# Altium project FMC_130MSPS.PrjPCB (part 1 of 2)
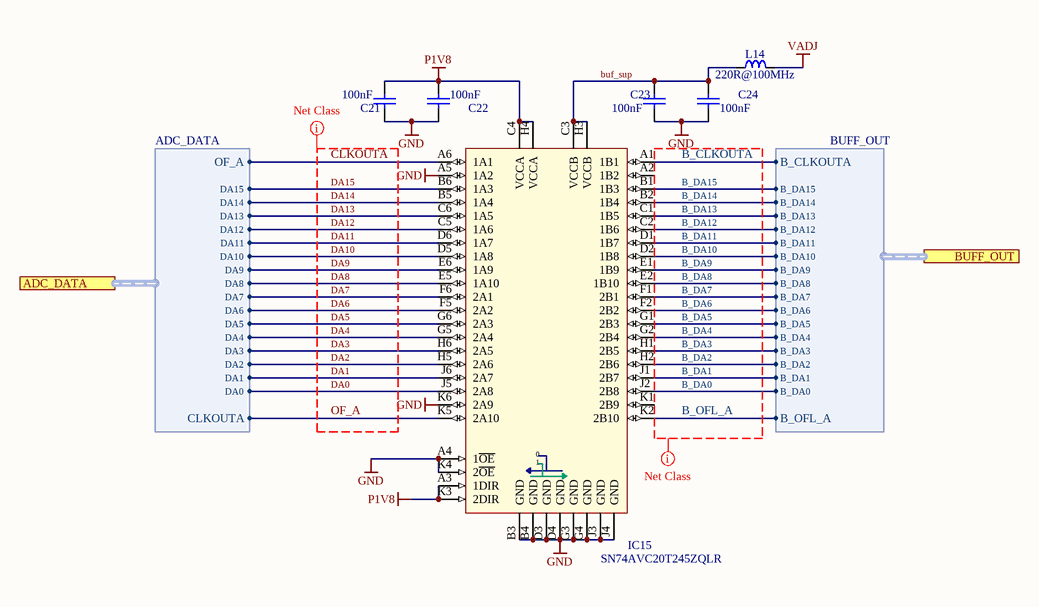
[diagram p0: BUFFER.SchDoc]
5 sheets, 124 parts. Net scope: hierarchical (ports join the sheet entries above them; power ports are global).
Board file: FMC_ADC_130M_16B_4CH.PcbDoc
Sheets:
  BUFFER.SchDoc
  FMC connector.SchDoc
  ADC.SchDoc
  power_supply.SchDoc
  Triggers.SchDoc

## Sheet BUFFER.SchDoc
size A4

### Parts
C21  100nF  [CAPC0603X33N]
C22  100nF  [CAPC0603X33N]
C23  100nF  [CAPC0603X33N]
C24  100nF  [CAPC0603X33N]
IC15  SN74AVC20T245ZQLR  [ZQL56(R-PBGA-N56)]
L14  220R@100MHz  [INDC2012X105N]

### Ports
ADC_DATA (harness ADC_DATA), BUFF_OUT (harness BUFF_OUT)

### Harnesses
BUFF_OUT: B_CLKOUTA, B_OFL_A, B_DA15, B_DA14, B_DA13, B_DA12, B_DA11, B_DA10, B_DA9, B_DA8, B_DA7, B_DA6, B_DA5, B_DA4, B_DA3, B_DA2, B_DA1, B_DA0
ADC_DATA: CLKOUTA, OF_A, DA15, DA14, DA13, DA12, DA11, DA10, DA9, DA8, DA7, DA6, DA5, DA4, DA3, DA2, DA1, DA0

### Nets
GND: C21.1 C22.1 C23.1 C24.1 IC15.A4(1~{OE}) IC15.A5(1A2) IC15.B3(GND) IC15.B4(GND) IC15.D3(GND) IC15.D4(GND) IC15.G3(GND) IC15.G4(GND) IC15.J3(GND) IC15.J4(GND) IC15.K4(2~{OE}) IC15.K6(2A9)
P1V8: C21.2 C22.2 IC15.A3(1DIR) IC15.C4(VCCA) IC15.H4(VCCA) IC15.K3(2DIR)
VADJ: L14.2
B_CLKOUTA: IC15.A1(1B1) ; port BUFF_OUT.B_CLKOUTA
B_DA0: IC15.J2(2B8) ; port BUFF_OUT.B_DA0
B_DA1: IC15.J1(2B7) ; port BUFF_OUT.B_DA1
B_DA2: IC15.H2(2B6) ; port BUFF_OUT.B_DA2
B_DA3: IC15.H1(2B5) ; port BUFF_OUT.B_DA3
B_DA4: IC15.G2(2B4) ; port BUFF_OUT.B_DA4
B_DA5: IC15.G1(2B3) ; port BUFF_OUT.B_DA5
B_DA6: IC15.F2(2B2) ; port BUFF_OUT.B_DA6
B_DA7: IC15.F1(2B1) ; port BUFF_OUT.B_DA7
B_DA8: IC15.E2(1B10) ; port BUFF_OUT.B_DA8
B_DA9: IC15.E1(1B9) ; port BUFF_OUT.B_DA9
B_DA10: IC15.D2(1B8) ; port BUFF_OUT.B_DA10
B_DA11: IC15.D1(1B7) ; port BUFF_OUT.B_DA11
B_DA12: IC15.C2(1B6) ; port BUFF_OUT.B_DA12
B_DA13: IC15.C1(1B5) ; port BUFF_OUT.B_DA13
B_DA14: IC15.B2(1B4) ; port BUFF_OUT.B_DA14
B_DA15: IC15.B1(1B3) ; port BUFF_OUT.B_DA15
B_OFL_A: IC15.K2(2B10) ; port BUFF_OUT.B_OFL_A
buf_sup: C23.2 C24.2 IC15.C3(VCCB) IC15.H3(VCCB) L14.1
CLKOUTA: IC15.A6(1A1) ; port ADC_DATA.OF_A
DA0: IC15.J5(2A8) ; port ADC_DATA.DA0
DA1: IC15.J6(2A7) ; port ADC_DATA.DA1
DA2: IC15.H5(2A6) ; port ADC_DATA.DA2
DA3: IC15.H6(2A5) ; port ADC_DATA.DA3
DA4: IC15.G5(2A4) ; port ADC_DATA.DA4
DA5: IC15.G6(2A3) ; port ADC_DATA.DA5
DA6: IC15.F5(2A2) ; port ADC_DATA.DA6
DA7: IC15.F6(2A1) ; port ADC_DATA.DA7
DA8: IC15.E5(1A10) ; port ADC_DATA.DA8
DA9: IC15.E6(1A9) ; port ADC_DATA.DA9
DA10: IC15.D5(1A8) ; port ADC_DATA.DA10
DA11: IC15.D6(1A7) ; port ADC_DATA.DA11
DA12: IC15.C5(1A6) ; port ADC_DATA.DA12
DA13: IC15.C6(1A5) ; port ADC_DATA.DA13
DA14: IC15.B5(1A4) ; port ADC_DATA.DA14
DA15: IC15.B6(1A3) ; port ADC_DATA.DA15
OF_A: IC15.K5(2A10) ; port ADC_DATA.CLKOUTA

Not connected (* = marked no-connect by the designer): IC15 A2(1B2) K1(2B9)

### Layout directives
net class Buff_data: B_CLKOUTA, B_DA0, B_DA1, B_DA2, B_DA3, B_DA4, B_DA5, B_DA6, B_DA7, B_DA8, B_DA9, B_DA10, B_DA11, B_DA12, B_DA13, B_DA14, B_DA15, B_OFL_A
net class ADC_data: CLKOUTA, DA0, DA1, DA2, DA3, DA4, DA5, DA6, DA7, DA8, DA9, DA10, DA11, DA12, DA13, DA14, DA15, OF_A

### Notes on the sheet
- (in symbol 74AVC20T245) 0; 1

### Library data of the parts
C21-C24 = CC0201_100NF_6.3V_10%_X5R: Non-polarised capacitor; Part Description: SMD Multilayer Chip Ceramic Capacitor; Manufacturer: GENERIC; Manufacturer1 Part Number: 02016D104KAT2A; Voltage: 6.3V; TC: X5R; Tolerance: ±10%; Table: Capacitors SMD; Part Number: CC0201_100NF_6.3V_10%_X5R; Component Kind: Standard; Component Type: Standard; Pin Count: 2; Value: 100nF; Status: Not Recommended; Manufacturer Part Number: CC0201_100NF_6.3V_10%_X5R; Case: 0201; Mounted: Yes; Socket: No; SMD: Yes; Manufacturer1 Example: AVX; Manufacturer1 ComponentHeight: 0.33mm; HelpURL: \\cern.ch\dfs\Applications\Altium\Datasheets\CC0201_X5R_AVX.pdf; Author: CERN DEM JLC; CreateDate: 2007-12-03; LatestRevisionDate: 2007-12-03
IC15 = 74AVC20T245: 20-BIT DUAL SUPPLY BUS TRANSCEIVER; Supplier 1: Digi-Key; Supplier Part Number 1: 296-19097-1-ND; partnumber: SN74AVC20T245ZQLR
L14 = IND0805_MURATA_BLM21PG221SN1D: Inductor; Part Description: SMD EMIFIL Suppression Chip Ferrite Bead; Manufacturer: MURATA; Power: 2A; Resistance: 0.05R; Tolerance: ±25%; Table: Inductors SMD; Part Number: IND0805_MURATA_BLM21PG221SN1D; Component Kind: Standard; Component Type: Standard; Pin Count: 2; Value: 220R@100MHz; Status: None; Manufacturer Part Number: BLM21PG221SN1D; Case: 0805; Mounted: Yes; Socket: No; SMD: Yes; ComponentHeight: 1.05mm; HelpURL: \\cern.ch\dfs\Applications\Altium\Datasheets\IND0402_MURATA_BLM21P.pdf; Author: CERN DEM JLC; CreateDate: 25/1/2010; LatestRevisionDate: 25/1/2010

## Sheet FMC connector.SchDoc
size A3
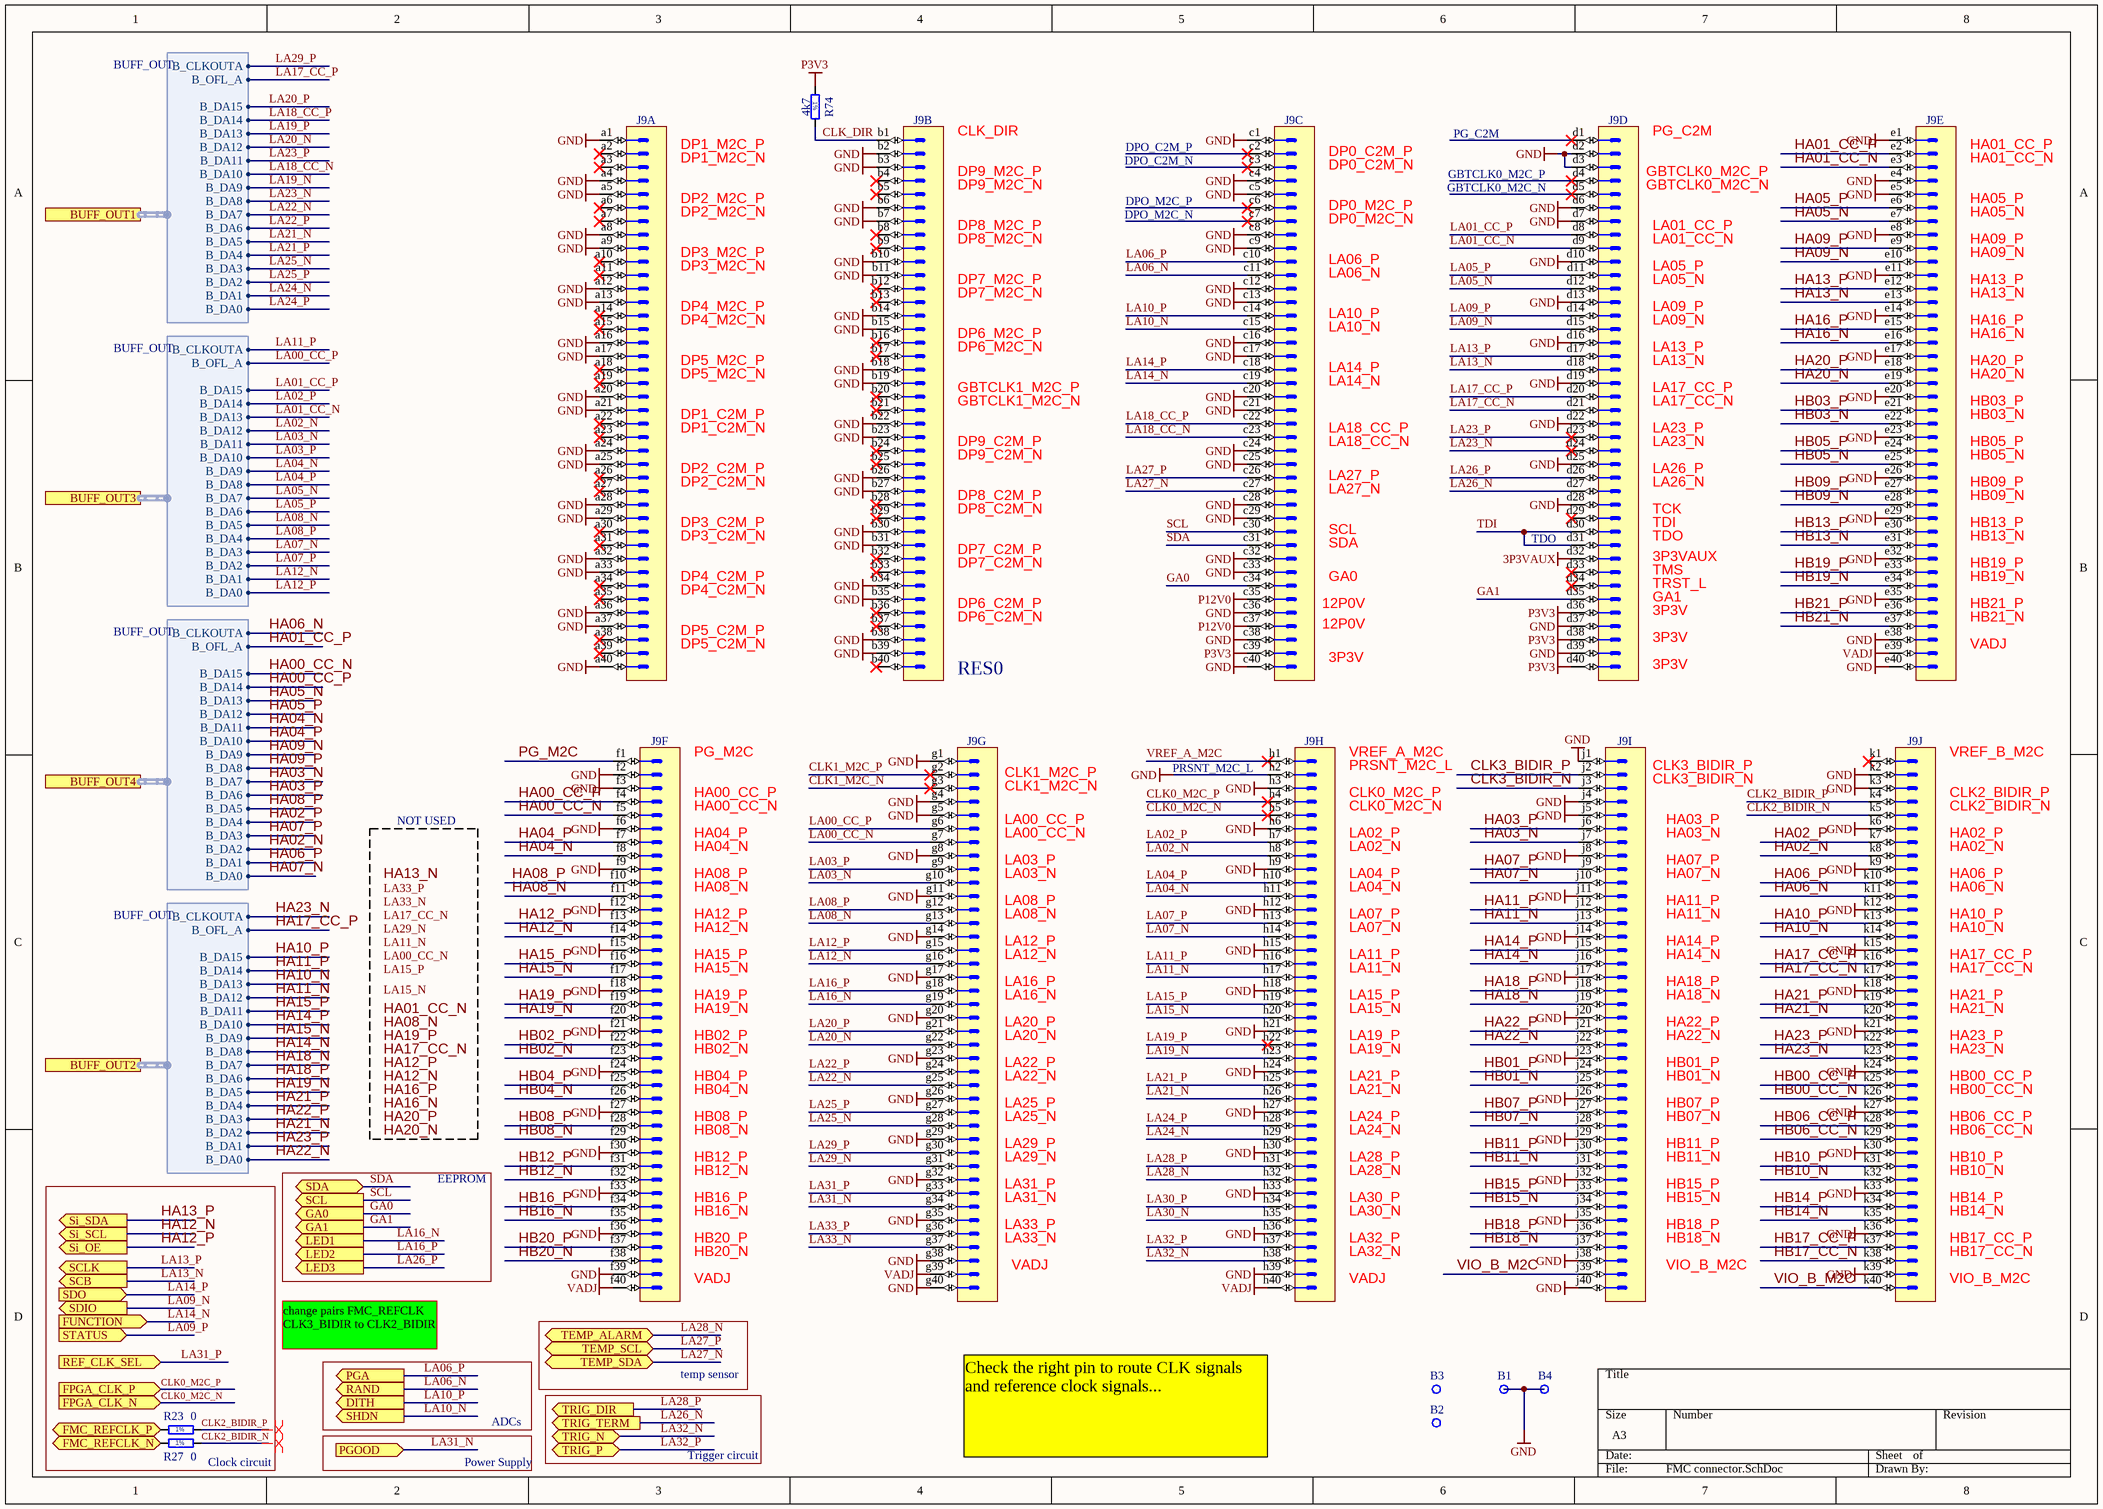
[diagram p1: FMC connector.SchDoc]

### Parts
B1  Plated Hole  [MTG300_600]  (value not drawn)
B2  Plated Hole  [MTG300_600]  (value not drawn)
B3  Plated Hole  [MTG300_600]  (value not drawn)
B4  Plated Hole  [MTG300_600]  (value not drawn)
J9  VITA 57  [SAMTEC_ASP-134488-01]  (value not drawn)  (parts A,B,C,D,E,F,G,H,I,J of 10)
R23  0  [RESC1005X40N]
R27  0  [RESC1005X40N]
R74  4k7  [RESC1608X55N]

### Blocks framed on the sheet
Clock circuit: R23 R27

### Ports
BUFF_OUT1 (harness BUFF_OUT), BUFF_OUT2 (harness BUFF_OUT), BUFF_OUT3 (harness BUFF_OUT), BUFF_OUT4 (harness BUFF_OUT), DITH (out), FMC_REFCLK_N (out), FMC_REFCLK_P (out), FPGA_CLK_N (in), FPGA_CLK_P (in), FUNCTION (in), GA0 (out), GA1 (out), LED1 (out), LED2 (out), LED3 (out), PGA (out), PGOOD (in), RAND (out), REF_CLK_SEL (in), SCB (out), SCL (out), SCLK (out), SDA (bidir), SDIO (out), SDO (in), SHDN (out), Si_OE (out), Si_SCL (out), Si_SDA (out), STATUS (in), TEMP_ALARM (bidir), TEMP_SCL (bidir), TEMP_SDA (bidir), TRIG_DIR (out), TRIG_N (bidir), TRIG_P (bidir), TRIG_TERM (out)

### Harnesses
BUFF_OUT: B_CLKOUTA, B_OFL_A, B_DA0, B_DA1, B_DA2, B_DA3, B_DA4, B_DA5, B_DA6, B_DA7, B_DA8, B_DA9, B_DA10, B_DA11, B_DA12, B_DA13, B_DA14, B_DA15

### Nets
3P3VAUX: J9.d32
GND: B1.1 B4.1 J9.a1 J9.a4 J9.a5 J9.a8 J9.a9 J9.a12 J9.a13 J9.a16 J9.a17 J9.a20 J9.a21 J9.a24 J9.a25 J9.a28 J9.a29 J9.a32 J9.a33 J9.a36 J9.a37 J9.a40 J9.b2 J9.b3 J9.b6 J9.b7 J9.b10 J9.b11 J9.b14 J9.b15 J9.b18 J9.b19 J9.b22 J9.b23 J9.b26 J9.b27 J9.b30 J9.b31 J9.b34 J9.b35 J9.b38 J9.b39 J9.c1 J9.c4 J9.c5 J9.c8 J9.c9 J9.c12 J9.c13 J9.c16 J9.c17 J9.c20 J9.c21 J9.c24 J9.c25 J9.c28 J9.c29 J9.c32 J9.c33 J9.c36 J9.c38 J9.c40 J9.d2 J9.d3 J9.d6 J9.d7 J9.d10 J9.d13 J9.d16 J9.d19 J9.d22 J9.d25 J9.d28 J9.d37 J9.d39 J9.e1 J9.e4 J9.e5 J9.e8 J9.e11 J9.e14 J9.e17 J9.e20 J9.e23 J9.e26 J9.e29 J9.e32 J9.e35 J9.e38 J9.e40 J9.f2 J9.f3 J9.f6 J9.f9 J9.f12 J9.f15 J9.f18 J9.f21 J9.f24 J9.f27 J9.f30 J9.f33 J9.f36 J9.f39 J9.g1 J9.g4 J9.g5 J9.g8 J9.g11 J9.g14 J9.g17 J9.g20 J9.g23 J9.g26 J9.g29 J9.g32 J9.g35 J9.g38 J9.g40 J9.h2 J9.h3 J9.h6 J9.h9 J9.h12 J9.h15 J9.h18 J9.h21 J9.h24 J9.h27 J9.h30 J9.h33 J9.h36 J9.h39 J9.j1 J9.j4 J9.j5 J9.j8 J9.j11 J9.j14 J9.j17 J9.j20 J9.j23 J9.j26 J9.j29 J9.j32 J9.j35 J9.j38 J9.j40 J9.k2 J9.k3 J9.k6 J9.k9 J9.k12 J9.k15 J9.k18 J9.k21 J9.k24 J9.k27 J9.k30 J9.k33 J9.k36 J9.k39
P3V3: J9.c39 J9.d36 J9.d38 J9.d40 R74.1
P12V0: J9.c35 J9.c37
VADJ: J9.e39 J9.f40 J9.g39 J9.h40
CLK0_M2C_N: J9.h5 ; port FPGA_CLK_N
CLK0_M2C_P: J9.h4 ; port FPGA_CLK_P
CLK1_M2C_N: J9.g3
CLK1_M2C_P: J9.g2
CLK2_BIDIR_N: J9.k5 R27.2
CLK2_BIDIR_P: J9.k4 R23.2
CLK3_BIDIR_N: J9.j3
CLK3_BIDIR_P: J9.j2
CLK_DIR: J9.b1 R74.2
GA0: J9.c34 ; port GA0
GA1: J9.d35 ; port GA1
HA00_CC_N: J9.f5 ; port BUFF_OUT4.B_DA15
HA00_CC_P: J9.f4 ; port BUFF_OUT4.B_DA14
HA01_CC_N: J9.e3
HA01_CC_P: J9.e2 ; port BUFF_OUT4.B_OFL_A
HA02_N: J9.k8 ; port BUFF_OUT4.B_DA2
HA02_P: J9.k7 ; port BUFF_OUT4.B_DA4
HA03_N: J9.j7 ; port BUFF_OUT4.B_DA7
HA03_P: J9.j6 ; port BUFF_OUT4.B_DA6
HA04_N: J9.f8 ; port BUFF_OUT4.B_DA11
HA04_P: J9.f7 ; port BUFF_OUT4.B_DA10
HA05_N: J9.e7 ; port BUFF_OUT4.B_DA13
HA05_P: J9.e6 ; port BUFF_OUT4.B_DA12
HA06_N: J9.k11 ; port BUFF_OUT4.B_CLKOUTA
HA06_P: J9.k10 ; port BUFF_OUT4.B_DA1
HA07_N: J9.j10 ; port BUFF_OUT4.B_DA0
HA07_P: J9.j9 ; port BUFF_OUT4.B_DA3
HA08_N: J9.f11
HA08_P: J9.f10 ; port BUFF_OUT4.B_DA5
HA09_N: J9.e10 ; port BUFF_OUT4.B_DA9
HA09_P: J9.e9 ; port BUFF_OUT4.B_DA8
HA10_N: J9.k14 ; port BUFF_OUT2.B_DA13
HA10_P: J9.k13 ; port BUFF_OUT2.B_DA15
HA11_N: J9.j13 ; port BUFF_OUT2.B_DA12
HA11_P: J9.j12 ; port BUFF_OUT2.B_DA14
HA12_N: J9.f14 ; port Si_SCL
HA12_P: J9.f13 ; port Si_OE
HA13_N: J9.e13
HA13_P: J9.e12 ; port Si_SDA
HA14_N: J9.j16 ; port BUFF_OUT2.B_DA8
HA14_P: J9.j15 ; port BUFF_OUT2.B_DA10
HA15_N: J9.f17 ; port BUFF_OUT2.B_DA9
HA15_P: J9.f16 ; port BUFF_OUT2.B_DA11
HA16_N: J9.e16
HA16_P: J9.e15
HA17_CC_N: J9.k17
HA17_CC_P: J9.k16 ; port BUFF_OUT2.B_OFL_A
HA18_N: J9.j19 ; port BUFF_OUT2.B_DA7
HA18_P: J9.j18 ; port BUFF_OUT2.B_DA6
HA19_N: J9.f20 ; port BUFF_OUT2.B_DA5
HA19_P: J9.f19
HA20_N: J9.e19
HA20_P: J9.e18
HA21_N: J9.k20 ; port BUFF_OUT2.B_DA2
HA21_P: J9.k19 ; port BUFF_OUT2.B_DA4
HA22_N: J9.j22 ; port BUFF_OUT2.B_DA0
HA22_P: J9.j21 ; port BUFF_OUT2.B_DA3
HA23_N: J9.k23 ; port BUFF_OUT2.B_CLKOUTA
HA23_P: J9.k22 ; port BUFF_OUT2.B_DA1
HB00_CC_N: J9.k26
HB00_CC_P: J9.k25
HB01_N: J9.j25
HB01_P: J9.j24
HB02_N: J9.f23
HB02_P: J9.f22
HB03_N: J9.e22
HB03_P: J9.e21
HB04_N: J9.f26
HB04_P: J9.f25
HB05_N: J9.e25
HB05_P: J9.e24
HB06_CC_N: J9.k29
HB06_CC_P: J9.k28
HB07_N: J9.j28
HB07_P: J9.j27
HB08_N: J9.f29
HB08_P: J9.f28
HB09_N: J9.e28
HB09_P: J9.e27
HB10_N: J9.k32
HB10_P: J9.k31
HB11_N: J9.j31
HB11_P: J9.j30
HB12_N: J9.f32
HB12_P: J9.f31
HB13_N: J9.e31
HB13_P: J9.e30
HB14_N: J9.k35
HB14_P: J9.k34
HB15_N: J9.j34
HB15_P: J9.j33
HB16_N: J9.f35
HB16_P: J9.f34
HB17_CC_N: J9.k38
HB17_CC_P: J9.k37
HB18_N: J9.j37
HB18_P: J9.j36
HB19_N: J9.e34
HB19_P: J9.e33
HB20_N: J9.f38
HB20_P: J9.f37
HB21_N: J9.e37
HB21_P: J9.e36
LA00_CC_N: J9.g7
LA00_CC_P: J9.g6 ; port BUFF_OUT3.B_OFL_A
LA01_CC_N: J9.d9 ; port BUFF_OUT3.B_DA13
LA01_CC_P: J9.d8 ; port BUFF_OUT3.B_DA15
LA02_N: J9.h8 ; port BUFF_OUT3.B_DA12
LA02_P: J9.h7 ; port BUFF_OUT3.B_DA14
LA03_N: J9.g10 ; port BUFF_OUT3.B_DA11
LA03_P: J9.g9 ; port BUFF_OUT3.B_DA10
LA04_N: J9.h11 ; port BUFF_OUT3.B_DA9
LA04_P: J9.h10 ; port BUFF_OUT3.B_DA8
LA05_N: J9.d12 ; port BUFF_OUT3.B_DA7
LA05_P: J9.d11 ; port BUFF_OUT3.B_DA6
LA06_N: J9.c11 ; port RAND
LA06_P: J9.c10 ; port PGA
LA07_N: J9.h14 ; port BUFF_OUT3.B_DA3
LA07_P: J9.h13 ; port BUFF_OUT3.B_DA2
LA08_N: J9.g13 ; port BUFF_OUT3.B_DA5
LA08_P: J9.g12 ; port BUFF_OUT3.B_DA4
LA09_N: J9.d15 ; port SDIO
LA09_P: J9.d14 ; port STATUS
LA10_N: J9.c15 ; port SHDN
LA10_P: J9.c14 ; port DITH
LA11_N: J9.h17
LA11_P: J9.h16 ; port BUFF_OUT3.B_CLKOUTA
LA12_N: J9.g16 ; port BUFF_OUT3.B_DA1
LA12_P: J9.g15 ; port BUFF_OUT3.B_DA0
LA13_N: J9.d18 ; port SCB
LA13_P: J9.d17 ; port SCLK
LA14_N: J9.c19 ; port FUNCTION
LA14_P: J9.c18 ; port SDO
LA15_N: J9.h20
LA15_P: J9.h19
LA16_N: J9.g19 ; port LED1
LA16_P: J9.g18 ; port LED2
LA17_CC_N: J9.d21
LA17_CC_P: J9.d20 ; port BUFF_OUT1.B_OFL_A
LA18_CC_N: J9.c23 ; port BUFF_OUT1.B_DA10
LA18_CC_P: J9.c22 ; port BUFF_OUT1.B_DA14
LA19_N: J9.h23 ; port BUFF_OUT1.B_DA9
LA19_P: J9.h22 ; port BUFF_OUT1.B_DA13
LA20_N: J9.g22 ; port BUFF_OUT1.B_DA12
LA20_P: J9.g21 ; port BUFF_OUT1.B_DA15
LA21_N: J9.h26 ; port BUFF_OUT1.B_DA5
LA21_P: J9.h25 ; port BUFF_OUT1.B_DA4
LA22_N: J9.g25 ; port BUFF_OUT1.B_DA7
LA22_P: J9.g24 ; port BUFF_OUT1.B_DA6
LA23_N: J9.d24 ; port BUFF_OUT1.B_DA8
LA23_P: J9.d23 ; port BUFF_OUT1.B_DA11
LA24_N: J9.h29 ; port BUFF_OUT1.B_DA1
LA24_P: J9.h28 ; port BUFF_OUT1.B_DA0
LA25_N: J9.g28 ; port BUFF_OUT1.B_DA3
LA25_P: J9.g27 ; port BUFF_OUT1.B_DA2
LA26_N: J9.d27 ; port TRIG_TERM
LA26_P: J9.d26 ; port LED3
LA27_N: J9.c27 ; port TEMP_SDA
LA27_P: J9.c26 ; port TEMP_SCL
LA28_N: J9.h32 ; port TEMP_ALARM
LA28_P: J9.h31 ; port TRIG_DIR
LA29_N: J9.g31
LA29_P: J9.g30 ; port BUFF_OUT1.B_CLKOUTA
LA30_N: J9.h35
LA30_P: J9.h34
LA31_N: J9.g34 ; port PGOOD
LA31_P: J9.g33 ; port REF_CLK_SEL
LA32_N: J9.h38 ; port TRIG_N
LA32_P: J9.h37 ; port TRIG_P
LA33_N: J9.g37
LA33_P: J9.g36
PG_M2C: J9.f1
SCL: J9.c30 ; port SCL
SDA: J9.c31 ; port SDA
TDI: J9.d30 J9.d31
VIO_B_M2C: J9.j39 J9.k40
VREF_A_M2C: J9.h1
NetR23_1: R23.1 ; port FMC_REFCLK_P
NetR27_1: R27.1 ; port FMC_REFCLK_N

Not connected (* = marked no-connect by the designer): B2 1; B3 1; J9 a2* a3* a6* a7* a10* a11* a14* a15* a18* a19* a22* a23* a26* a27* a30* a31* a34* a35* a38* a39* b4* b5* b8* b9* b12* b13* b16* b17* b20* b21* b24* b25* b28* b29* b32* b33* b36* b37* b40* c2* c3* c6* c7* d1* d4* d5* d29* d33* d34* k1*

### Layout directives
differential pair: CLK2_BIDIR_N, CLK2_BIDIR_P

### Notes on the sheet
- DP1_M2C_P
- DP1_M2C_N
- CLK_DIR
- DP9_M2C_P
- DPO_C2M_P
- DPO_C2M_N
- DP0_C2M_P
- DP0_C2M_N
- PG_C2M
- GBTCLK0_M2C_P
- GBTCLK0_M2C_N
- (near J9) GBTCLK0_M2C_P
- HA01_CC_P
- HA01_CC_N
- DP2_M2C_P
- DP2_M2C_N
- DP9_M2C_N
- DP8_M2C_P
- DP8_M2C_N
- DPO_M2C_P
- DPO_M2C_N
- DP0_M2C_P
- DP0_M2C_N
- (near J9) GBTCLK0_M2C_N
- LA01_CC_P
- LA01_CC_N
- HA05_P
- HA05_N
- HA09_P
- DP3_M2C_P
- DP3_M2C_N
- DP4_M2C_P
- DP7_M2C_P
- DP7_M2C_N
- LA06_P
- LA06_N
- LA10_P
- LA05_P
- LA05_N
- LA09_P
- HA09_N
- HA13_P
- HA13_N
- DP4_M2C_N
- DP5_M2C_P
- DP5_M2C_N
- DP6_M2C_P
- DP6_M2C_N
- LA10_N
- LA14_P
- LA09_N
- LA13_P
- LA13_N
- HA16_P
- HA16_N
- HA20_P
- HA20_N
- DP1_C2M_P
- DP1_C2M_N
- GBTCLK1_M2C_P
- GBTCLK1_M2C_N
- DP9_C2M_P
- LA14_N
- LA18_CC_P
- LA18_CC_N
- LA17_CC_P
- LA17_CC_N
- LA23_P
- LA23_N
- HB03_P
- HB03_N
- HB05_P
- DP2_C2M_P
- DP2_C2M_N
- DP9_C2M_N
- DP8_C2M_P
- DP8_C2M_N
- LA27_P
- LA27_N
- LA26_P
- LA26_N
- TCK
- HB05_N
- HB09_P
- HB09_N
- DP3_C2M_P
- DP3_C2M_N
- DP4_C2M_P
- DP7_C2M_P
- DP7_C2M_N
- SCL
- SDA
- GA0
- (near J9) TDO
- TDI
- TDO
- 3P3VAUX
- TMS
- TRST_L
- HB13_P
- HB13_N
- HB19_P
- HB19_N
- DP4_C2M_N
- DP5_C2M_P
- DP5_C2M_N
- DP6_C2M_P
- DP6_C2M_N
- (near J9) 12P0V
- GA1
- 3P3V
- HB21_P
- HB21_N
- VADJ
- RES0
- PG_M2C
- (near J9) CLK1_M2C_P
- (near J9) PRSNT_M2C_L
- VREF_A_M2C
- PRSNT_M2C_L
- (near J9) CLK3_BIDIR_P
- (near J9) CLK3_BIDIR_N
- VREF_B_M2C
- NOT USED
- HA00_CC_P
- HA00_CC_N
- HA04_P
- HA04_N
- (near J9) CLK1_M2C_N
- (near J9) LA00_CC_P
- (near J9) LA00_CC_N
- CLK0_M2C_P
- CLK0_M2C_N
- LA02_P
- LA02_N
- HA03_P
- HA03_N
- CLK2_BIDIR_P
- CLK2_BIDIR_N
- HA02_P
- HA02_N
- HA08_P
- HA08_N
- HA12_P
- (near J9) LA03_P
- (near J9) LA03_N
- (near J9) LA08_P
- (near J9) LA08_N
- LA04_P
- LA04_N
- LA07_P
- HA07_P
- HA07_N
- HA11_P
- HA11_N
- HA06_P
- HA06_N
- HA10_P
- HA12_N
- HA15_P
- HA15_N
- (near J9) LA12_P
- (near J9) LA12_N
- (near J9) LA16_P
- LA07_N
- LA11_P
- LA11_N
- HA14_P
- HA14_N
- HA18_P
- HA10_N
- HA17_CC_P
- HA17_CC_N
- HA19_P
- HA19_N
- HB02_P
- HB02_N
- (near J9) LA16_N
- (near J9) LA20_P
- (near J9) LA20_N
- LA15_P
- LA15_N
- LA19_P
- LA19_N
- HA18_N
- HA22_P
- HA22_N
- HA21_P
- HA21_N
- HA23_P
- HA23_N
- HB04_P
- HB04_N
- HB08_P
- (near J9) LA22_P
- (near J9) LA22_N
- (near J9) LA25_P
- (near J9) LA25_N
- LA21_P
- LA21_N
- LA24_P
- HB01_P
- HB01_N
- HB07_P
- HB07_N
- HB00_CC_P
- HB00_CC_N
- HB06_CC_P
- EEPROM
- HB08_N
- HB12_P
- HB12_N
- (near J9) LA29_P
- (near J9) LA29_N
- (near J9) LA31_P
- LA24_N
- LA28_P
- LA28_N
- HB11_P
- HB11_N
- HB15_P
- HB06_CC_N
- HB10_P
- HB10_N
- HB16_P
- HB16_N
- HB20_P
- HB20_N
- (near J9) LA31_N
- (near J9) LA33_P
- (near J9) LA33_N
- LA30_P
- LA30_N
- LA32_P
- LA32_N
- HB15_N
- HB18_P
- HB18_N
- HB14_P
- HB14_N
- HB17_CC_P
- HB17_CC_N
- VIO_B_M2C
- change pairs FMC_REFCLK CLK3_BIDIR to CLK2_BIDIR
- temp sensor
- ADCs
- Trigger circuit
- Check the right pin to route CLK signals and reference clock signals...
- Power Supply
- Labels drawn without touching a wire or pin: HA01_CC_N, HA08_N, HA12_N, HA12_P, HA13_N, HA16_N, HA16_P, HA17_CC_N, HA19_P, HA20_N, HA20_P, LA00_CC_N, LA11_N, LA15_N, LA15_P, LA17_CC_N, LA29_N, LA33_N, LA33_P
- (in symbol R0402_0R_JUMPER) 1%
- (in symbol R0603_4K7_1%_0.1W_100PPM) 1%

### Library data of the parts
B1-B4 = PLATED_HOLE3.0_PAD6.0: Single Terminal Socket; Part Description: Plated Through Hole: Hole Dia.=3.0mm Pad Dia.=6.0mm; Mounted: No; Table: Pads; Part Number: PLATED_HOLE3.0_PAD6.0; Component Kind: Standard (No BOM); Component Type: Standard (No BOM); Designator: Single Terminal Socket; Library Reference: Single Terminal Socket; Pin Count: 1; Family: Plated Hole; Socket: No; SMD: No; Status: None; ComponentHeight: 0mm; Author: CERN DEM JLC; CreateDate: 26.05.2008; LatestRevisionDate: 26.05.2008; PackageDescription: Plated Through Hole: Hole Dia.=3.0mm Pad Dia.=6.0mm
J9 = SAMTEC_ASP-134488-01: Connector VITA 57, 400 Male contacts in 10 row abcdefghj; Part Description: 400 contacts (10 rows abcdefghj) Surface Mount Male Connector, VITA 57 (MC-HPC-10); Manufacturer: SAMTEC; Part Number: SAMTEC_ASP-134488-01; Component Kind: Standard; Component Type: Standard; Pin Count: 400; Family: VITA 57; Mounted: Yes; Socket: No; SMD: Yes; Status: None; Manufacturer Part Number: ASP-134488-01; ComponentHeight: 6.1mm; HelpURL: \\cern.ch\dfs\Applications\Altium\Datasheets\SAMTEC_ASP-134488-01.pdf; Author: CERN DEM JLC; CreateDate: 30/04/2009; LatestRevisionDate: 17/08/2009; Table: SAMTEC
R23 R27 = R0402_0R_JUMPER: Resistor - 1%; Part Description: 1A (0.05R Max DC Resistance) Zero Ohm Jumper; Manufacturer: GENERIC; Manufacturer1 Part Number: 232270591001L; Table: Resistors SMD; Part Number: R0402_0R_JUMPER; Component Kind: Standard; Component Type: Standard; Pin Count: 2; Value: 0; Status: Not recommended; Manufacturer Part Number: R0402_0R_JUMPER; Case: 0402; Mounted: Yes; Socket: No; SMD: Yes; Manufacturer1 Example: YAGEO PHYCOMP; Manufacturer1 ComponentHeight: 0.4mm; HelpURL: \\cern.ch\dfs\Applications\Altium\Datasheets\R0402_Phycomp_RC0402.pdf; Author: CERN DEM JLC; CreateDate: 3/12/2007; LatestRevisionDate: 17/10/2012
R74 = R0603_4K7_1%_0.1W_100PPM: Resistor - 1%; Part Description: General Purpose Thick Film Chip Resistor; Manufacturer: GENERIC; Manufacturer1 Part Number: NRC06F4701TRF; Power: 0.1W; TC: ±100ppm/°C; Table: Resistors SMD; Part Number: R0603_4K7_1%_0.1W_100PPM; Component Kind: Standard; Component Type: Standard; Pin Count: 2; Value: 4k7; Status: Preferred; Tolerance: ±1%; Manufacturer Part Number: R0603_4K7_1%_0.1W_100PPM; Case: 0603; Mounted: Yes; Socket: No; SMD: Yes; Manufacturer1 Example: NIC COMPONENT; Manufacturer1 ComponentHeight: 0.55mm; HelpURL: \\cern.ch\dfs\Applications\Altium\Datasheets\R0603_NIC_NRC.pdf; Author: CERN DEM JLC; CreateDate: 03/12/2007; LatestRevisionDate: 13/03/2008

## Sheet ADC.SchDoc
size A3
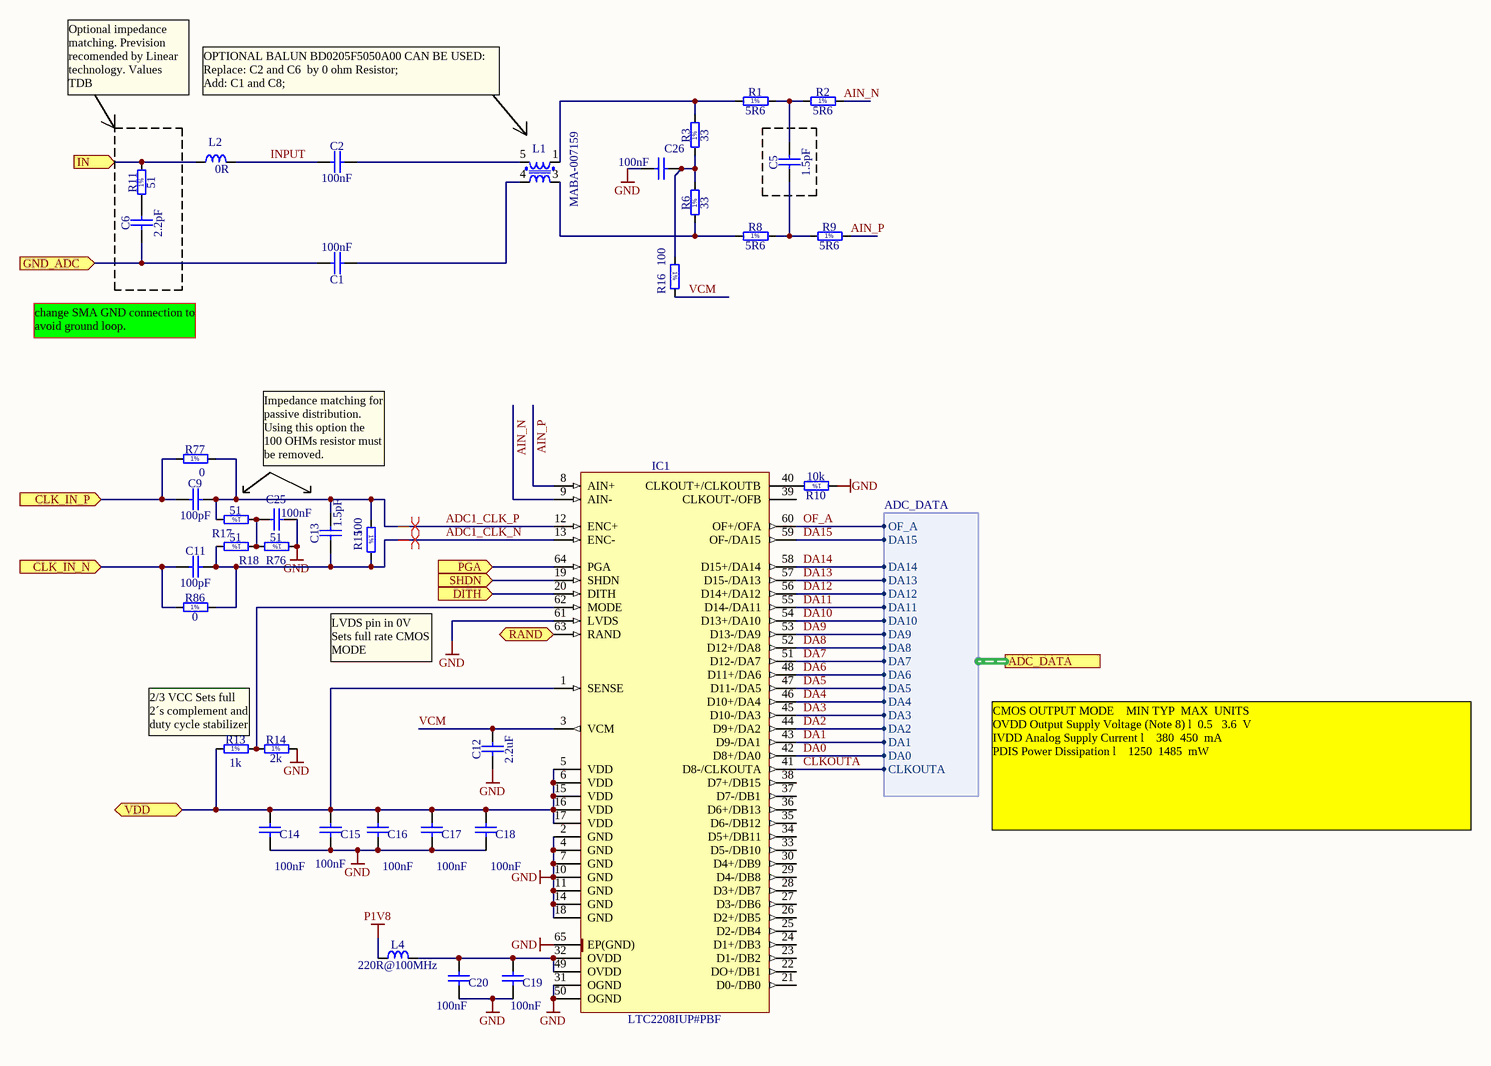
[diagram p2: ADC.SchDoc]

### Parts
C1  100nF  [CAPC0603X33N]
C2  100nF  [CAPC0603X33N]
C5  1.5pF  [CAPC1005X55N]
C6  2.2pF  [CAPC1005X55N]
C9  100pF  [CAPC1005X55N]
C11  100pF  [CAPC1005X55N]
C12  2.2uF  [CAPC1608X87N]
C13  1.5pF  [CAPC1005X55N]
C14  100nF  [CAPC0603X33N]
C15  100nF  [CAPC0603X33N]
C16  100nF  [CAPC0603X33N]
C17  100nF  [CAPC0603X33N]
C18  100nF  [CAPC0603X33N]
C19  100nF  [CAPC0603X33N]
C20  100nF  [CAPC0603X33N]
C25  100nF  [CAPC0603X33N]
C26  100nF  [CAPC0603X33N]
IC1  LTC2208IUP#PBF  [QFN50P900X900X80-65N-S725]
L1  MABA-007159  [XFMR_MA-COM_SM-22 (H260)]
L2  0R  [INDC1005X55N]
L4  220R@100MHz  [INDC2012X105N]
R1  5R6  [RESC1005X40N]
R2  5R6  [RESC1005X40N]
R3  33  [RESC1005X40N]
R6  33  [RESC1005X40N]
R8  5R6  [RESC1005X40N]
R9  5R6  [RESC1005X40N]
R10  10k  [RESC1005X40N]
R11  51  [RESC1005X40N]
R13  1k  [RESC1005X40N]
R14  2k  [RESC1005X40N]
R15  100  [RESC1005X40N]
R16  100  [RESC1005X40N]
R17  51  [RESC1005X40N]
R18  51  [RESC1005X40N]
R76  51  [RESC1005X40N]
R77  0  [RESC1005X40N]
R86  0  [RESC1005X40N]

### Ports
ADC_DATA (harness ADC_DATA), CLK_IN_N (in), CLK_IN_P (in), DITH (in), GND_ADC (in), IN (in), PGA (in), RAND (in), SHDN (in), VDD

### Harnesses
ADC_DATA: CLKOUTA, DA0, DA1, DA2, DA3, DA4, DA5, DA6, DA7, DA8, DA9, DA10, DA11, DA12, DA13, DA14, DA15, OF_A

### Nets
GND: C12.1 C14.1 C15.1 C16.1 C17.1 C18.1 C19.1 C20.1 C25.1 C26.2 IC1.2(GND) IC1.4(GND) IC1.7(GND) IC1.10(GND) IC1.11(GND) IC1.14(GND) IC1.18(GND) IC1.31(OGND) IC1.50(OGND) IC1.61(LVDS) IC1.65(EP(GND)) R10.1 R14.2 R76.1
P1V8: L4.1
ADC1_CLK_N: C11.2 C13.1 IC1.13(ENC-) R15.2 R18.2 R86.2
ADC1_CLK_P: C9.2 C13.2 IC1.12(ENC+) R15.1 R17.2 R77.2
AIN_N: IC1.9(AIN-) R2.2
AIN_P: IC1.8(AIN+) R9.2
CLKOUTA: IC1.41(D8-/CLKOUTA) ; port ADC_DATA.CLKOUTA
DA0: IC1.42(D8+/DA0) ; port ADC_DATA.DA0
DA1: IC1.43(D9-/DA1) ; port ADC_DATA.DA1
DA2: IC1.44(D9+/DA2) ; port ADC_DATA.DA2
DA3: IC1.45(D10-/DA3) ; port ADC_DATA.DA3
DA4: IC1.46(D10+/DA4) ; port ADC_DATA.DA4
DA5: IC1.47(D11-/DA5) ; port ADC_DATA.DA5
DA6: IC1.48(D11+/DA6) ; port ADC_DATA.DA6
DA7: IC1.51(D12-/DA7) ; port ADC_DATA.DA7
DA8: IC1.52(D12+/DA8) ; port ADC_DATA.DA8
DA9: IC1.53(D13-/DA9) ; port ADC_DATA.DA9
DA10: IC1.54(D13+/DA10) ; port ADC_DATA.DA10
DA11: IC1.55(D14-/DA11) ; port ADC_DATA.DA11
DA12: IC1.56(D14+/DA12) ; port ADC_DATA.DA12
DA13: IC1.57(D15-/DA13) ; port ADC_DATA.DA13
DA14: IC1.58(D15+/DA14) ; port ADC_DATA.DA14
DA15: IC1.59(OF-/DA15) ; port ADC_DATA.DA15
INPUT: C2.1 L2.2
OF_A: IC1.60(OF+/OFA) ; port ADC_DATA.OF_A
VCM: C12.2 IC1.3(VCM) R16.2
NetC1_1: C1.1 L1.4
NetC1_2: C1.2 C6.1 ; port GND_ADC
NetC2_2: C2.2 L1.5
NetC5_1: C5.1 R8.2 R9.1
NetC5_2: C5.2 R1.2 R2.1
NetC6_2: C6.2 R11.1
NetC9_1: C9.1 R77.1 ; port CLK_IN_P
NetC11_1: C11.1 R86.1 ; port CLK_IN_N
NetC14_2: C14.2 C15.2 C16.2 C17.2 C18.2 IC1.1(SENSE) IC1.5(VDD) IC1.6(VDD) IC1.15(VDD) IC1.16(VDD) IC1.17(VDD) R13.1 ; port VDD
NetC19_2: C19.2 C20.2 IC1.32(OVDD) IC1.49(OVDD) L4.2
NetC25_2: C25.2 R17.1 R18.1 R76.2
NetC26_1: C26.1 R3.1 R6.2 R16.1
NetIC1_19: IC1.19(SHDN) ; port SHDN
NetIC1_20: IC1.20(DITH) ; port DITH
NetIC1_40: IC1.40(CLKOUT+/CLKOUTB) R10.2
NetIC1_62: IC1.62(MODE) R13.2 R14.1
NetIC1_63: IC1.63(RAND) ; port RAND
NetIC1_64: IC1.64(PGA) ; port PGA
NetL1_1: L1.1 R1.1 R3.2
NetL1_3: L1.3 R6.1 R8.1
NetL2_1: L2.1 R11.2 ; port IN

Not connected (* = marked no-connect by the designer): IC1 21(D0-/DB0) 22(DO+/DB1) 23(D1-/DB2) 24(D1+/DB3) 25(D2-/DB4) 26(D2+/DB5) 27(D3-/DB6) 28(D3+/DB7) 29(D4-/DB8) 30(D4+/DB9) 33(D5-/DB10) 34(D5+/DB11) 35(D6-/DB12) 36(D6+/DB13) 37(D7-/DB1) 38(D7+/DB15) 39(CLKOUT-/OFB)

### Layout directives
differential pair: ADC1_CLK_N, ADC1_CLK_P

### Notes on the sheet
- Optional impedance matching. Prevision recomended by Linear technology. Values TDB
- OPTIONAL BALUN BD0205F5050A00 CAN BE USED:
  Replace: C2 and C6  by 0 ohm Resistor;
  Add: C1 and C8;
- change SMA GND connection to avoid ground loop.
- Impedance matching for passive distribution. Using this option the 100 OHMs resistor must be removed.
- LVDS pin in 0V Sets full rate CMOS MODE
- 2/3 VCC Sets full 2´s complement and duty cycle stabilizer
- CMOS OUTPUT MODE 	 	MIN	TYP 	MAX 	UNITS
  OVDD Output Supply Voltage (Note 8) l 	0.5 		3.6 	V
  IVDD Analog Supply Current l 			380 	450	 mA
  PDIS Power Dissipation l 			1250 	1485 	mW
- (in symbol R0402_0R_JUMPER) 1%
- (in symbol R0402_1K_1%_0.0625W_100PPM) 1%
- (in symbol R0402_2K_1%_0.0625W_100PPM) 1%
- (in symbol R0402_5R6_1%_0.0625W_200PPM) 1%
- (in symbol R0402_10K_1%_0.0625W_100PPM) 1%
- (in symbol R0402_33R_1%_0.0625W_100PPM) 1%
- (in symbol R0402_51R_1%_0.0625W_100PPM) 1%
- (in symbol R0402_100R_1%_0.0625W_100PPM) 1%

### Library data of the parts
C1 C2 C14-C20 C25 C26 = CC0201_100NF_6.3V_10%_X5R: as C21 on sheet BUFFER; Part Number: CC0201_100NF_6.3V_10%_X5R; Component Kind: Standard; Component Type: Standard; Pin Count: 2; Value: 100nF; Status: Not Recommended; Manufacturer Part Number: CC0201_100NF_6.3V_10%_X5R; Case: 0201; Mounted: Yes; Socket: No; SMD: Yes; Manufacturer1 Example: AVX; Manufacturer1 ComponentHeight: 0.33mm; HelpURL: \\cern.ch\dfs\Applications\Altium\Datasheets\CC0201_X5R_AVX.pdf; Author: CERN DEM JLC; CreateDate: 2007-12-03; LatestRevisionDate: 2007-12-03
C5 C13 = CC0402_1.5PF_50V_0.25PF_NP0: Non-polarised capacitor; Part Description: SMD Multilayer Chip Ceramic Capacitor; Manufacturer: GENERIC; Manufacturer1 Part Number: 223886915158; Voltage: 50V; TC: NP0; Tolerance: ±0.25pF; Table: Capacitors SMD; Part Number: CC0402_1.5PF_50V_0.25PF_NP0; Component Kind: Standard; Component Type: Standard; Pin Count: 2; Value: 1.5pF; Status: Not Recommended; Manufacturer Part Number: CC0402_1.5PF_50V_0.25PF_NP0; Case: 0402; Mounted: Yes; Socket: No; SMD: Yes; Manufacturer1 Example: PHYCOMP; Manufacturer1 ComponentHeight: 0.55mm; HelpURL: \\cern.ch\dfs\Applications\Altium\Datasheets\CC0402_NP0_PHYCOMP.pdf; Author: CERN DEM JLC; CreateDate: 3/12/2007; LatestRevisionDate: 3/12/2007
C6 = CC0402_2.2PF_50V_0.25PF_NP0: Non-polarised capacitor; Part Description: SMD Multilayer Chip Ceramic Capacitor; Manufacturer: GENERIC; Manufacturer1 Part Number: 223886915228; Voltage: 50V; TC: NP0; Tolerance: ±0.25pF; Table: Capacitors SMD; Part Number: CC0402_2.2PF_50V_0.25PF_NP0; Component Kind: Standard; Component Type: Standard; Pin Count: 2; Value: 2.2pF; Status: Not Recommended; Manufacturer Part Number: CC0402_2.2PF_50V_0.25PF_NP0; Case: 0402; Mounted: Yes; Socket: No; SMD: Yes; Manufacturer1 Example: PHYCOMP; Manufacturer1 ComponentHeight: 0.55mm; HelpURL: \\cern.ch\dfs\Applications\Altium\Datasheets\CC0402_NP0_PHYCOMP.pdf; Author: CERN DEM JLC; CreateDate: 2007-12-03; LatestRevisionDate: 2007-12-03
C9 C11 = CC0402_100PF_50V_5%_NP0: Non-polarised capacitor; Part Description: SMD Multilayer Chip Ceramic Capacitor; Manufacturer: GENERIC; Manufacturer1 Part Number: 223886915101; Voltage: 50V; TC: NP0; Tolerance: ±5%; Table: Capacitors SMD; Part Number: CC0402_100PF_50V_5%_NP0; Component Kind: Standard; Component Type: Standard; Pin Count: 2; Value: 100pF; Status: Not Recommended; Manufacturer Part Number: CC0402_100PF_50V_5%_NP0; Case: 0402; Mounted: Yes; Socket: No; SMD: Yes; Manufacturer1 Example: PHYCOMP; Manufacturer1 ComponentHeight: 0.55mm; HelpURL: \\cern.ch\dfs\Applications\Altium\Datasheets\CC0402_NP0_PHYCOMP.pdf; Author: CERN DEM JLC; CreateDate: 3/12/2007; LatestRevisionDate: 3/12/2007
C12 = CC0603_2.2UF_16V_10%_X5R: Non-polarised capacitor; Part Description: SMD Multilayer Chip Ceramic Capacitor; Manufacturer: GENERIC; Manufacturer1 Part Number: CC0603KRX5R7BB225; Voltage: 16V; TC: X5R; Tolerance: ±10%; Table: Capacitors SMD; Part Number: CC0603_2.2UF_16V_10%_X5R; Component Kind: Standard; Component Type: Standard; Pin Count: 2; Value: 2.2uF; Status: Preferred; Manufacturer Part Number: CC0603_2.2UF_16V_10%_X5R; Case: 0603; Mounted: Yes; Socket: No; SMD: Yes; Manufacturer1 Example: YAGEO; Manufacturer1 ComponentHeight: 0.9mm; HelpURL: \\cern.ch\dfs\Applications\Altium\Datasheets\CC0805_X5R_PHYCOMP_HC.pdf; Author: CERN DEM JLC; CreateDate: 28/4/2011; LatestRevisionDate: 28/4/2011
IC1 = LTC2LTC2208IUP#PBF: 16-Bit, 130Msps ADC; Manufacturer: LINEAR TECHNOLOGY; Table: Analog & Interface; Part Number: LTC2LTC2208IUP#PBF; Component Kind: Standard; Component Type: Standard; Device: LTC2208IUP#PBF; PackageDescription: QFN, 0.50mm Pitch, Square; 64 Pin, 9.00mm L X 9.00mm W X 0.80mm H body (7.25mm X 7.25mm Thermal Tab), IPC Medium Density; Part Description: 16-Bit, 130Msps ADC; Manufacturer Part Number: LTC2208IUP#PBF; Pin Count: 65; Case: QFN64; Mounted: Yes; Socket: No; SMD: Yes; ComponentHeight: 0.8mm; Author: CERN DEM JLC; HelpURL: \\cern.ch\dfs\Applications\Altium\Datasheets\LTC2208IUP#PBF.pdf; CreateDate: 18/9/2012; LatestRevisionDate: 18/9/2012
L1 = XFMR_MA-COM_MABA-007159-000000_modified: MA-COM E-Serie RF 1:1 Transmission Line Ttransformer 4.5-3000MHz; name: MABA-007159
L2 = IND0402_MURATA_BLM15HB221SN1: Inductor; Part Description: SMD EMIFIL Suppression Chip Ferrite Bead; Manufacturer: MURATA; Value: 220R@100MHz; Power: 250mA; Resistance: 1R; Tolerance: ±25%; Table: Inductors SMD; Part Number: IND0402_MURATA_BLM15HB221SN1; Component Kind: Standard; Component Type: Standard; Pin Count: 2; Status: None; Manufacturer Part Number: BLM15HB221SN1; Case: 0402; Mounted: Yes; Socket: No; SMD: Yes; ComponentHeight: 0.55mm; HelpURL: \\cern.ch\dfs\Applications\Altium\Datasheets\IND0402_MURATA_BLM15H.pdf; Author: CERN DEM JLC; CreateDate: 23/6/2009; LatestRevisionDate: 23/6/2009
L4 = IND0805_MURATA_BLM21PG221SN1D: as L14 on sheet BUFFER; Part Number: IND0805_MURATA_BLM21PG221SN1D; Component Kind: Standard; Component Type: Standard; Pin Count: 2; Value: 220R@100MHz; Status: None; Manufacturer Part Number: BLM21PG221SN1D; Case: 0805; Mounted: Yes; Socket: No; SMD: Yes; ComponentHeight: 1.05mm; HelpURL: \\cern.ch\dfs\Applications\Altium\Datasheets\IND0402_MURATA_BLM21P.pdf; Author: CERN DEM JLC; CreateDate: 25/1/2010; LatestRevisionDate: 25/1/2010
R1 R2 R8 R9 = R0402_5R6_1%_0.0625W_200PPM: Resistor - 1%; Part Description: General Purpose Thick Film Chip Resistor; Manufacturer: GENERIC; Manufacturer1 Part Number: 232270675608L; TC: ±200ppm/°C; Table: Resistors SMD; Part Number: R0402_5R6_1%_0.0625W_200PPM; Component Kind: Standard; Component Type: Standard; Pin Count: 2; Value: 5R6; Status: Not recommended; Power: 0.0625W; Tolerance: ±1%; Manufacturer Part Number: R0402_5R6_1%_0.0625W_200PPM; Case: 0402; Mounted: Yes; Socket: No; SMD: Yes; Manufacturer1 Example: YAGEO PHYCOMP; Manufacturer1 ComponentHeight: 0.4mm; HelpURL: \\cern.ch\dfs\Applications\Altium\Datasheets\R0402_Phycomp_RC0402.pdf; Author: CERN DEM JLC; CreateDate: 24/6/2009; LatestRevisionDate: 17/10/2012
R3 R6 = R0402_33R_1%_0.0625W_100PPM: Resistor - 1%; Part Description: General Purpose Thick Film Chip Resistor; Manufacturer: GENERIC; Manufacturer1 Part Number: 232270673309L; TC: ±100ppm/°C; Table: Resistors SMD; Part Number: R0402_33R_1%_0.0625W_100PPM; Component Kind: Standard; Component Type: Standard; Pin Count: 2; Value: 33; Status: Not recommended; Power: 0.0625W; Tolerance: ±1%; Manufacturer Part Number: R0402_33R_1%_0.0625W_100PPM; Case: 0402; Mounted: Yes; Socket: No; SMD: Yes; Manufacturer1 Example: YAGEO PHYCOMP; Manufacturer1 ComponentHeight: 0.4mm; HelpURL: \\cern.ch\dfs\Applications\Altium\Datasheets\R0402_Phycomp_RC0402.pdf; Author: CERN DEM JLC; CreateDate: 03/12/2007; LatestRevisionDate: 17/10/2012
R10 = R0402_10K_1%_0.0625W_100PPM: Resistor - 1%; Part Description: General Purpose Thick Film Chip Resistor; Manufacturer: GENERIC; Manufacturer1 Part Number: 232270671003L; TC: ±100ppm/°C; Table: Resistors SMD; Part Number: R0402_10K_1%_0.0625W_100PPM; Component Kind: Standard; Component Type: Standard; Pin Count: 2; Value: 10k; Status: Not recommended; Power: 0.0625W; Tolerance: ±1%; Manufacturer Part Number: R0402_10K_1%_0.0625W_100PPM; Case: 0402; Mounted: Yes; Socket: No; SMD: Yes; Manufacturer1 Example: YAGEO PHYCOMP; Manufacturer1 ComponentHeight: 0.4mm; HelpURL: \\cern.ch\dfs\Applications\Altium\Datasheets\R0402_Phycomp_RC0402.pdf; Author: CERN DEM JLC; CreateDate: 3/12/2007; LatestRevisionDate: 17/10/2012
R11 R17 R18 R76 = R0402_51R_1%_0.0625W_100PPM: Resistor - 1%; Part Description: General Purpose Thick Film Chip Resistor; Manufacturer: GENERIC; Manufacturer1 Part Number: 232270675109L; TC: ±100ppm/°C; Table: Resistors SMD; Part Number: R0402_51R_1%_0.0625W_100PPM; Component Kind: Standard; Component Type: Standard; Pin Count: 2; Value: 51; Status: Not recommended; Power: 0.0625W; Tolerance: ±1%; Manufacturer Part Number: R0402_51R_1%_0.0625W_100PPM; Case: 0402; Mounted: Yes; Socket: No; SMD: Yes; Manufacturer1 Example: YAGEO PHYCOMP; Manufacturer1 ComponentHeight: 0.4mm; HelpURL: \\cern.ch\dfs\Applications\Altium\Datasheets\R0402_Phycomp_RC0402.pdf; Author: CERN DEM JLC; CreateDate: 3/12/2007; LatestRevisionDate: 17/10/2012
R13 = R0402_1K_1%_0.0625W_100PPM: Resistor - 1%; Part Description: General Purpose Thick Film Chip Resistor; Manufacturer: GENERIC; Manufacturer1 Part Number: 232270671002L; TC: ±100ppm/°C; Table: Resistors SMD; Part Number: R0402_1K_1%_0.0625W_100PPM; Component Kind: Standard; Component Type: Standard; Pin Count: 2; Value: 1k; Status: Not recommended; Power: 0.0625W; Tolerance: ±1%; Manufacturer Part Number: R0402_1K_1%_0.0625W_100PPM; Case: 0402; Mounted: Yes; Socket: No; SMD: Yes; Manufacturer1 Example: YAGEO PHYCOMP; Manufacturer1 ComponentHeight: 0.4mm; HelpURL: \\cern.ch\dfs\Applications\Altium\Datasheets\R0402_Phycomp_RC0402.pdf; Author: CERN DEM JLC; CreateDate: 3/12/2007; LatestRevisionDate: 17/10/2012
R14 = R0402_2K_1%_0.0625W_100PPM: Resistor - 1%; Part Description: General Purpose Thick Film Chip Resistor; Manufacturer: GENERIC; Manufacturer1 Part Number: 232270672002L; TC: ±100ppm/°C; Table: Resistors SMD; Part Number: R0402_2K_1%_0.0625W_100PPM; Component Kind: Standard; Component Type: Standard; Pin Count: 2; Value: 2k; Status: Not recommended; Power: 0.0625W; Tolerance: ±1%; Manufacturer Part Number: R0402_2K_1%_0.0625W_100PPM; Case: 0402; Mounted: Yes; Socket: No; SMD: Yes; Manufacturer1 Example: YAGEO PHYCOMP; Manufacturer1 ComponentHeight: 0.4mm; HelpURL: \\cern.ch\dfs\Applications\Altium\Datasheets\R0402_Phycomp_RC0402.pdf; Author: CERN DEM JLC; CreateDate: 3/12/2007; LatestRevisionDate: 17/10/2012
R15 R16 = R0402_100R_1%_0.0625W_100PPM: Resistor - 1%; Part Description: General Purpose Thick Film Chip Resistor; Manufacturer: GENERIC; Manufacturer1 Part Number: 232270671001L; TC: ±100ppm/°C; Table: Resistors SMD; Part Number: R0402_100R_1%_0.0625W_100PPM; Component Kind: Standard; Component Type: Standard; Pin Count: 2; Value: 100; Status: Not recommended; Power: 0.0625W; Tolerance: ±1%; Manufacturer Part Number: R0402_100R_1%_0.0625W_100PPM; Case: 0402; Mounted: Yes; Socket: No; SMD: Yes; Manufacturer1 Example: YAGEO PHYCOMP; Manufacturer1 ComponentHeight: 0.4mm; HelpURL: \\cern.ch\dfs\Applications\Altium\Datasheets\R0402_Phycomp_RC0402.pdf; Author: CERN DEM JLC; CreateDate: 3/12/2007; LatestRevisionDate: 17/10/2012
R77 R86 = R0402_0R_JUMPER: Resistor - 1%; Part Description: 1A (0.05R Max DC Resistance) Zero Ohm Jumper; Manufacturer: GENERIC; Manufacturer1 Part Number: 232270591001; Table: Resistors SMD; Part Number: R0402_0R_JUMPER; Component Kind: Standard; Component Type: Standard; Pin Count: 2; Value: 0; Status: Not recommended; Manufacturer Part Number: R0402_0R_JUMPER; Case: 0402; Mounted: Yes; Socket: No; SMD: Yes; Manufacturer1 Example: PHYCOMP; Manufacturer1 ComponentHeight: 0.4mm; HelpURL: \\cern.ch\dfs\Applications\Altium\Datasheets\R0402_Phycomp_RC0402.pdf; Author: CERN DEM JLC; CreateDate: 2007-12-03; LatestRevisionDate: 2008-03-13